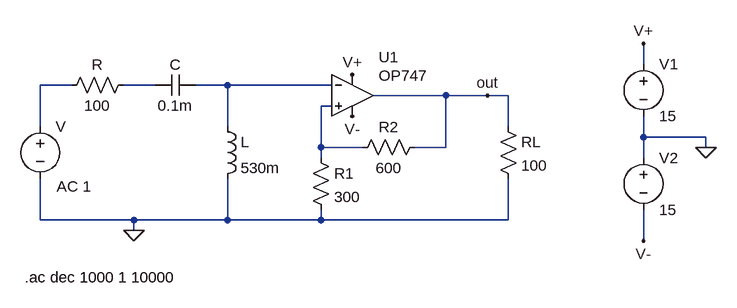
[diagram p0: schematic 04_3 Aktiver RLC-Filter Gegenkopplung Belastung.asc]
04_3 Aktiver RLC-Filter Gegenkopplung Belastung.asc, the LTspice schematic file:
Version 4
SHEET 1 1204 680
WIRE 832 96 832 64
WIRE -48 128 -96 128
WIRE 80 128 32 128
WIRE 192 128 144 128
WIRE 352 128 192 128
WIRE 528 144 416 144
WIRE 592 144 528 144
WIRE 624 144 592 144
WIRE 352 160 336 160
WIRE -96 192 -96 128
WIRE 192 192 192 128
WIRE 624 192 624 144
WIRE 832 208 832 176
WIRE 928 208 832 208
WIRE 336 224 336 160
WIRE 400 224 336 224
WIRE 528 224 528 144
WIRE 528 224 480 224
WIRE 928 224 928 208
WIRE 336 240 336 224
WIRE 832 240 832 208
WIRE -96 336 -96 272
WIRE 48 336 -96 336
WIRE 192 336 192 272
WIRE 192 336 48 336
WIRE 336 336 336 320
WIRE 336 336 192 336
WIRE 624 336 624 272
WIRE 624 336 336 336
WIRE 48 352 48 336
WIRE 832 368 832 320
FLAG 48 352 0
FLAG 928 224 0
FLAG 832 64 V+
FLAG 832 368 V-
FLAG 384 112 V+
FLAG 384 176 V-
FLAG 592 144 out
SYMBOL res 48 112 R90
WINDOW 0 0 56 VBottom 2
WINDOW 3 32 56 VTop 2
SYMATTR InstName R
SYMATTR Value 100
SYMBOL ind 176 176 R0
SYMATTR InstName L
SYMATTR Value 530m
SYMBOL voltage -96 176 R0
WINDOW 123 25 108 Left 2
WINDOW 39 0 0 Left 0
SYMATTR Value2 AC 1
SYMATTR InstName V
SYMATTR Value ""
SYMBOL cap 144 112 R90
WINDOW 0 0 32 VBottom 2
WINDOW 3 32 32 VTop 2
SYMATTR InstName C
SYMATTR Value 0.1m
SYMBOL OpAmps\\OP747 384 80 R0
WINDOW 0 41 5 Left 2
WINDOW 3 41 33 Left 2
SYMATTR InstName U1
SYMBOL voltage 832 80 R0
WINDOW 123 0 0 Left 0
WINDOW 39 0 0 Left 0
SYMATTR InstName V1
SYMATTR Value 15
SYMBOL voltage 832 224 R0
WINDOW 123 0 0 Left 0
WINDOW 39 0 0 Left 0
SYMATTR InstName V2
SYMATTR Value 15
SYMBOL res 320 224 R0
SYMATTR InstName R1
SYMATTR Value 300
SYMBOL res 496 208 R90
WINDOW 0 0 56 VBottom 2
WINDOW 3 32 56 VTop 2
SYMATTR InstName R2
SYMATTR Value 600
SYMBOL res 608 176 R0
SYMATTR InstName RL
SYMATTR Value 100
TEXT -120 424 Left 2 !.ac dec 1000 1 10000

The netlist it stands for:
* 04_3 Aktiver RLC-Filter Gegenkopplung Belastung.asc
R N002 N001 100
L N003 0 530m
V N001 0 AC 1
C N003 N002 0.1m
XU1 N004 N003 V+ V- out OP747  ; pins In+ In- V+ V- OUT
V1 V+ 0 15
V2 0 V- 15
R1 N004 0 300
R2 out N004 600
RL out 0 100
.ac dec 1000 1 10000
.backanno
.end